# Altium schematic sheet Interface - Fan Control.SchDoc: [20] Interface - Fan Control
size A3; ApprovedBy: Nagy Richard; CheckedBy: Nagy Richard; Author: Nagy Richard; CompanyName: EmbedCore; DrawnBy: Nagy Richard; Engineer: Nagy Richard; Organization: EmbedCore; DocumentNumber: 20; Revision: 1.0; SheetNumber: 19; SheetTotal: 25
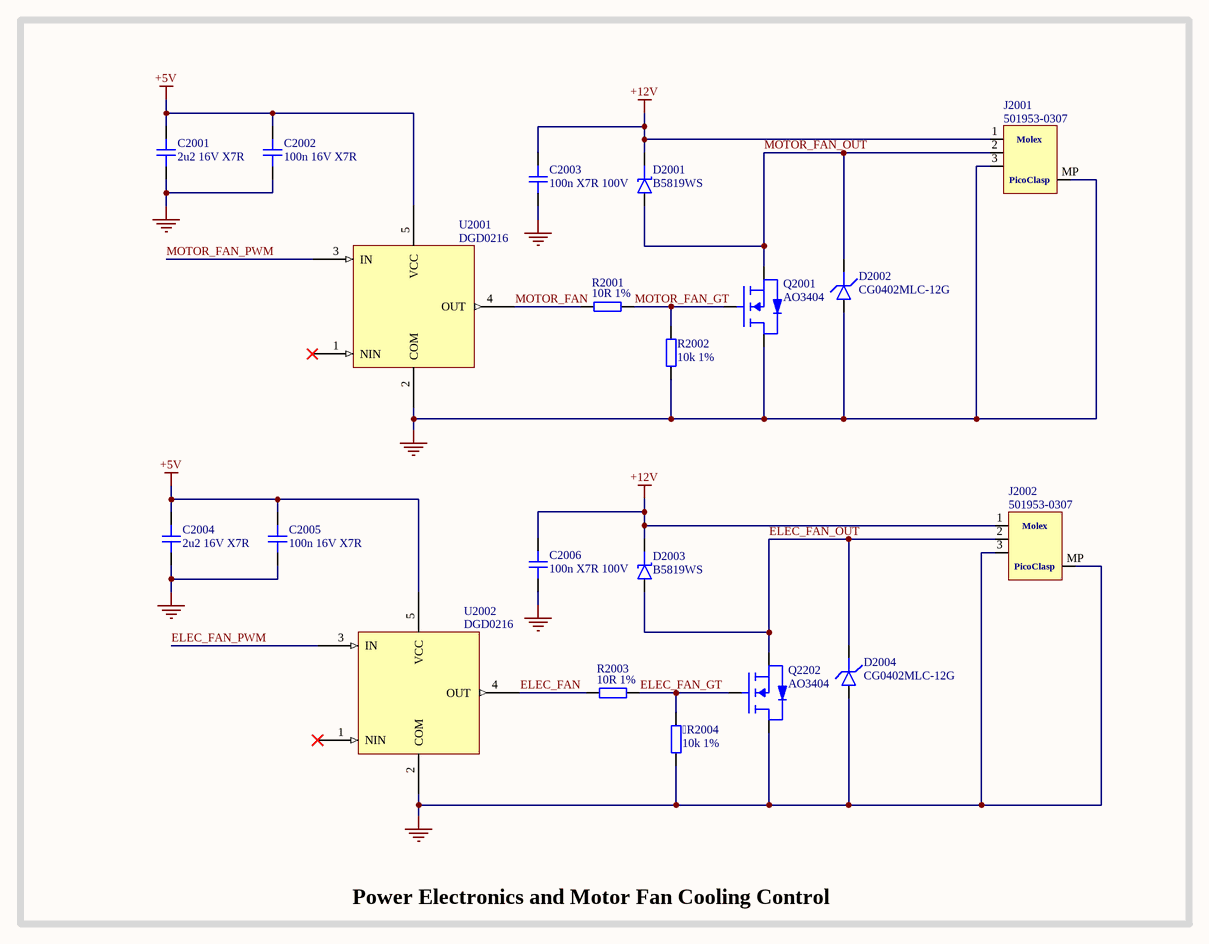
[diagram p0: Interface - Fan Control.SchDoc]

## Parts
R2004  10k 1%  [RES_0402]
C2001  2u2 16V X7R  [CAP_0603]
C2002  100n 16V X7R  [CAP_0402]
C2003  100n X7R 100V  [CAP_0603]
C2004  2u2 16V X7R  [CAP_0603]
C2005  100n 16V X7R  [CAP_0402]
C2006  100n X7R 100V  [CAP_0603]
D2001  B5819WS  [SOD-323]
D2002  CG0402MLC-12G  [D_0402]
D2003  B5819WS  [SOD-323]
D2004  CG0402MLC-12G  [D_0402]
J2001  501953-0307  [5019530307]
J2002  501953-0307  [5019530307]
Q2001  AO3404  [SSM3J338R,LF-SOT23-F]
Q2202  AO3404  [SSM3J338R,LF-SOT23-F]
R2001  10R 1%  [RES_0402]
R2002  10k 1%  [RES_0402]
R2003  10R 1%  [RES_0402]
U2001  DGD0216  [TSOT25]
U2002  DGD0216  [TSOT25]

## Blocks framed on the sheet
Power Electronics and Motor Fan Cooling Control: R2004 C2001-C2006 D2001-D2004 J2001 J2002 Q2001 Q2202 R2001-R2003 U2001 U2002

## Nets
+5V: C2001.2 C2002.2 C2004.2 C2005.2 U2001.5(VCC) U2002.5(VCC)
+12V: C2003.2 C2006.2 D2001.K D2003.K J2001.1 J2002.1
GND: R2004.1 C2001.1 C2002.1 C2003.1 C2004.1 C2005.1 C2006.1 D2002.A D2004.A J2001.3 J2001.MP J2002.3 J2002.MP Q2001.D Q2202.D R2002.1 U2001.2(COM) U2002.2(COM)
ELEC_FAN: R2003.2 U2002.4(OUT)
ELEC_FAN_GT: R2004.2 Q2202.G R2003.1
ELEC_FAN_OUT: D2003.A D2004.K J2002.2 Q2202.S
ELEC_FAN_PWM: U2002.3(IN)
MOTOR_FAN: R2001.2 U2001.4(OUT)
MOTOR_FAN_GT: Q2001.G R2001.1 R2002.2
MOTOR_FAN_OUT: D2001.A D2002.K J2001.2 Q2001.S
MOTOR_FAN_PWM: U2001.3(IN)

Not connected (* = marked no-connect by the designer): U2001 1(NIN)*; U2002 1(NIN)*

## Notes on the sheet
- Title:
- Drawn By:
- Page Contents:
- Checked By:
- Size:
- Date:
- File:
- License:
- Email:
- A4
- Number:
- Time:
- Revision:
- Sheet
- Website:
- of
- (in symbol 501953-0307) Molex; PicoClasp

## Library data of the parts
R2004 R2002 = RES_0402: Resistor SMD 0402; Manufacturer: PANASONIC; Manufacturer Part Number: ERJPA2F1002X; Distributor Link: www.lcsc.com; LCSC: C427247
C2001 C2004 = CAP_0603: Capacitor SMD 0603; Manufacturer: YAGEO; Manufacturer Part Number: CC0603KRX7R7BB225; Distributor Link: www.lcsc.com; LCSC: C914769; Rating: *; Dielectric: *
C2002 C2005 = CAP_0402: Capacitor SMD 0402; Manufacturer: YAGEO; Manufacturer Part Number: CC0402JRX7R7BB104; Distributor Link: www.lcsc.com; LCSC: C541464; Rating: *; Dielectric: *
C2003 C2006 = CAP_0603: Capacitor SMD 0603; Manufacturer: CCTC; Manufacturer Part Number: TCC0603X7R104K101CT; Distributor Link: www.lcsc.com; LCSC: C696916; Rating: *; Dielectric: *
D2001 D2003 = D_SCHOTTKY_SOD_323: Diode Schottky SMD SOD-323
D2002 D2004 = D_TVS_0402: Diode TVS / ESD 0402
J2001 J2002 = 501953-0307: Headers & Wire Housings 1.0WtBWaferAssyR/A1- -Row3Ckt+LKEmbsTpPkg
Q2001 Q2202 = 2N7002NXAKR: MOSFET N-Channel Vds=60V Id=300mA with ESD Protection; Manufacturer: TECH PUBLIC; Manufacturer Part Number: AO3404
R2001 R2003 = RES_0402: Resistor SMD 0402; Manufacturer: PANASONIC; Manufacturer Part Number: ERJPA2J100X; Distributor Link: www.lcsc.com; LCSC: C427198
U2001 U2002 = DGD0216: 1.5A HIGH SPEED SINGLE GATE DRIVER; Manufacturer: *; Manufacturer Part Number: *; LCSC: *